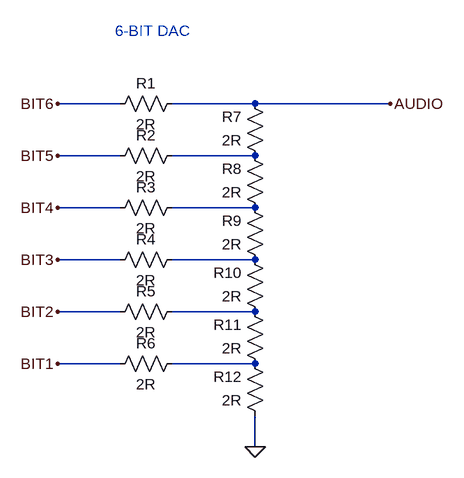
[diagram p0: schematic DAC.asc]
DAC.asc, the LTspice schematic file:
Version 4
SHEET 1 880 680
WIRE 80 16 -16 16
WIRE 288 16 160 16
WIRE 496 16 288 16
WIRE 80 96 -16 96
WIRE 288 96 160 96
WIRE 80 176 -16 176
WIRE 288 176 160 176
WIRE 80 256 -16 256
WIRE 288 256 160 256
WIRE 80 336 -16 336
WIRE 288 336 160 336
WIRE 80 416 -16 416
WIRE 288 416 160 416
WIRE 288 544 288 496
FLAG -16 16 BIT6
FLAG -16 96 BIT5
FLAG -16 176 BIT4
FLAG -16 256 BIT3
FLAG -16 336 BIT2
FLAG -16 416 BIT1
FLAG 496 16 AUDIO
FLAG 288 544 0
SYMBOL res 176 0 R90
WINDOW 0 0 56 VBottom 2
WINDOW 3 32 56 VTop 2
SYMATTR InstName R1
SYMATTR Value 2R
SYMBOL res 176 80 R90
WINDOW 0 0 56 VBottom 2
WINDOW 3 32 56 VTop 2
SYMATTR InstName R2
SYMATTR Value 2R
SYMBOL res 176 160 R90
WINDOW 0 0 56 VBottom 2
WINDOW 3 32 56 VTop 2
SYMATTR InstName R3
SYMATTR Value 2R
SYMBOL res 176 240 R90
WINDOW 0 0 56 VBottom 2
WINDOW 3 32 56 VTop 2
SYMATTR InstName R4
SYMATTR Value 2R
SYMBOL res 176 320 R90
WINDOW 0 0 56 VBottom 2
WINDOW 3 32 56 VTop 2
SYMATTR InstName R5
SYMATTR Value 2R
SYMBOL res 176 400 R90
WINDOW 0 0 56 VBottom 2
WINDOW 3 32 56 VTop 2
SYMATTR InstName R6
SYMATTR Value 2R
SYMBOL res 304 112 R180
WINDOW 0 36 76 Left 2
WINDOW 3 36 40 Left 2
SYMATTR InstName R7
SYMATTR Value 2R
SYMBOL res 304 192 R180
WINDOW 0 36 76 Left 2
WINDOW 3 36 40 Left 2
SYMATTR InstName R8
SYMATTR Value 2R
SYMBOL res 304 272 R180
WINDOW 0 36 76 Left 2
WINDOW 3 36 40 Left 2
SYMATTR InstName R9
SYMATTR Value 2R
SYMBOL res 304 352 R180
WINDOW 0 36 76 Left 2
WINDOW 3 36 40 Left 2
SYMATTR InstName R10
SYMATTR Value 2R
SYMBOL res 304 432 R180
WINDOW 0 36 76 Left 2
WINDOW 3 36 40 Left 2
SYMATTR InstName R11
SYMATTR Value 2R
SYMBOL res 304 512 R180
WINDOW 0 36 76 Left 2
WINDOW 3 36 40 Left 2
SYMATTR InstName R12
SYMATTR Value 2R
TEXT 72 -96 Left 2 ;6-BIT DAC

The netlist it stands for:
* DAC.asc
R1 AUDIO BIT6 2R
R2 N001 BIT5 2R
R3 N002 BIT4 2R
R4 N003 BIT3 2R
R5 N004 BIT2 2R
R6 N005 BIT1 2R
R7 N001 AUDIO 2R
R8 N002 N001 2R
R9 N003 N002 2R
R10 N004 N003 2R
R11 N005 N004 2R
R12 0 N005 2R
* 6-BIT DAC
.backanno
.end